# EAGLE design HamOrcaBoard (EAGLE 9.0.1)
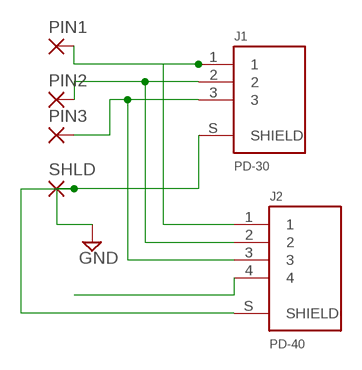
[diagram p0: schematic, sheet 1]

## Parts
J1  PD-30  [CUI_PD-30]
J2  PD-40  [CUI_PD-40]
PIN1  3,81/1,4  [3,81/1,4]
PIN2  3,81/1,4  [3,81/1,4]
PIN3  3,81/1,4  [3,81/1,4]
SHLD  3,81/1,4  [3,81/1,4]

## Nets
GND: J1.S(SHIELD) J2.S(SHIELD) SHLD.1(P)
N$1: J1.1 J2.1 PIN1.1(P)
N$2: J1.2 J2.2 PIN2.1(P)
N$3: J1.3 J2.3 PIN3.1(P)
N$4: J2.4

## Library data of the parts
J1 = PD-30:PD-30: 3 Position , 7.5 A, Right Angle, Through Hole, Power DIN Connector; MF: CUI Inc; PARTREV: B; STANDARD: Manufacturer recommendations
J2 = PD-40:PD-40: 4 Position , 7.5 A, Right Angle, Through Hole, Power DIN Connector; MF: CUI Inc; PARTREV: B; STANDARD: Manufacturer recommendations
PIN1-PIN3 SHLD = wirepad:3,81/1,4: THROUGH-HOLE PAD

## Board
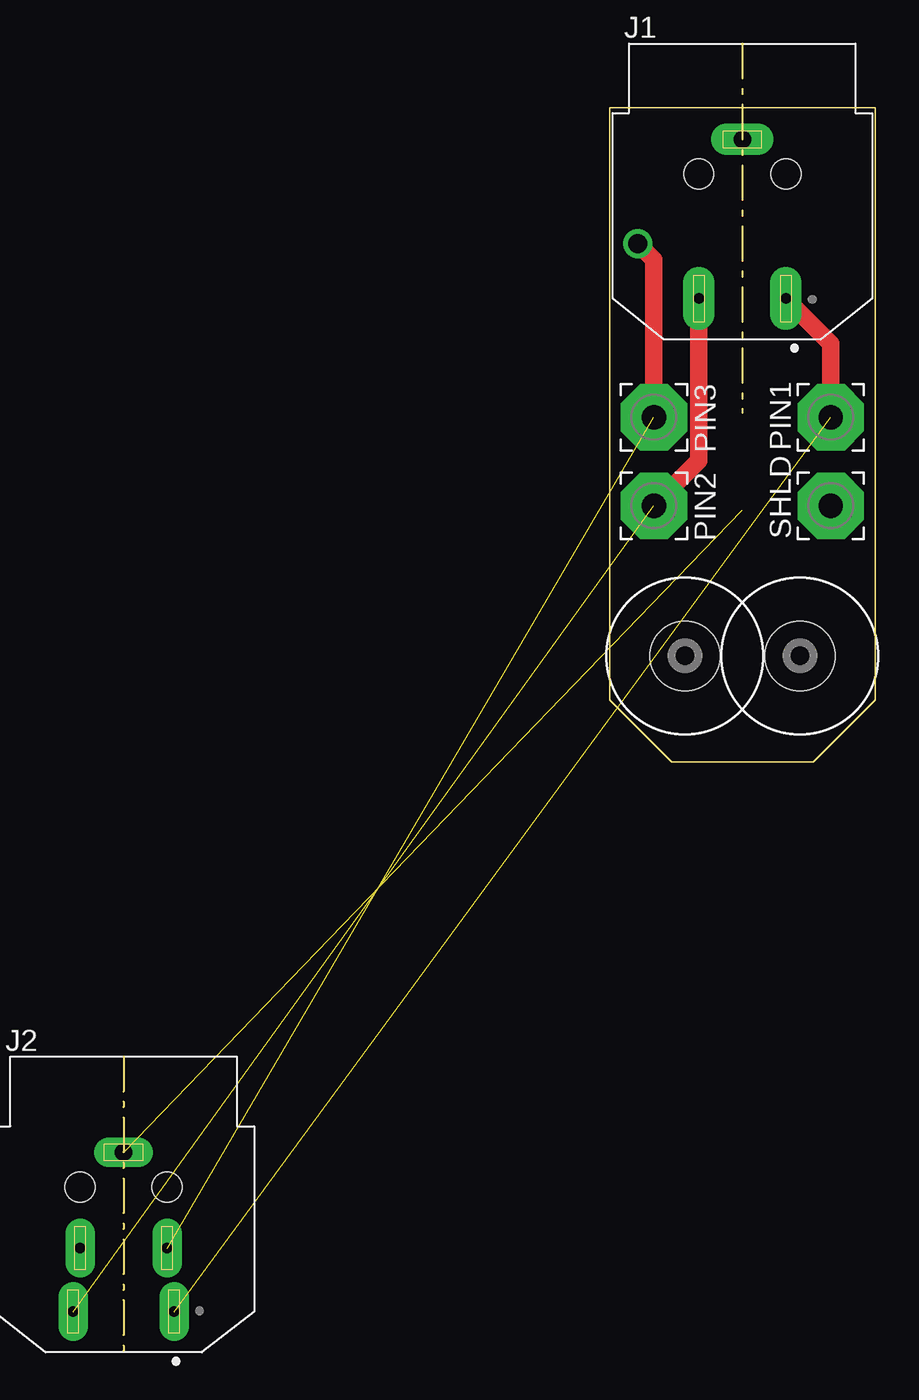
[diagram p1: board, top side]
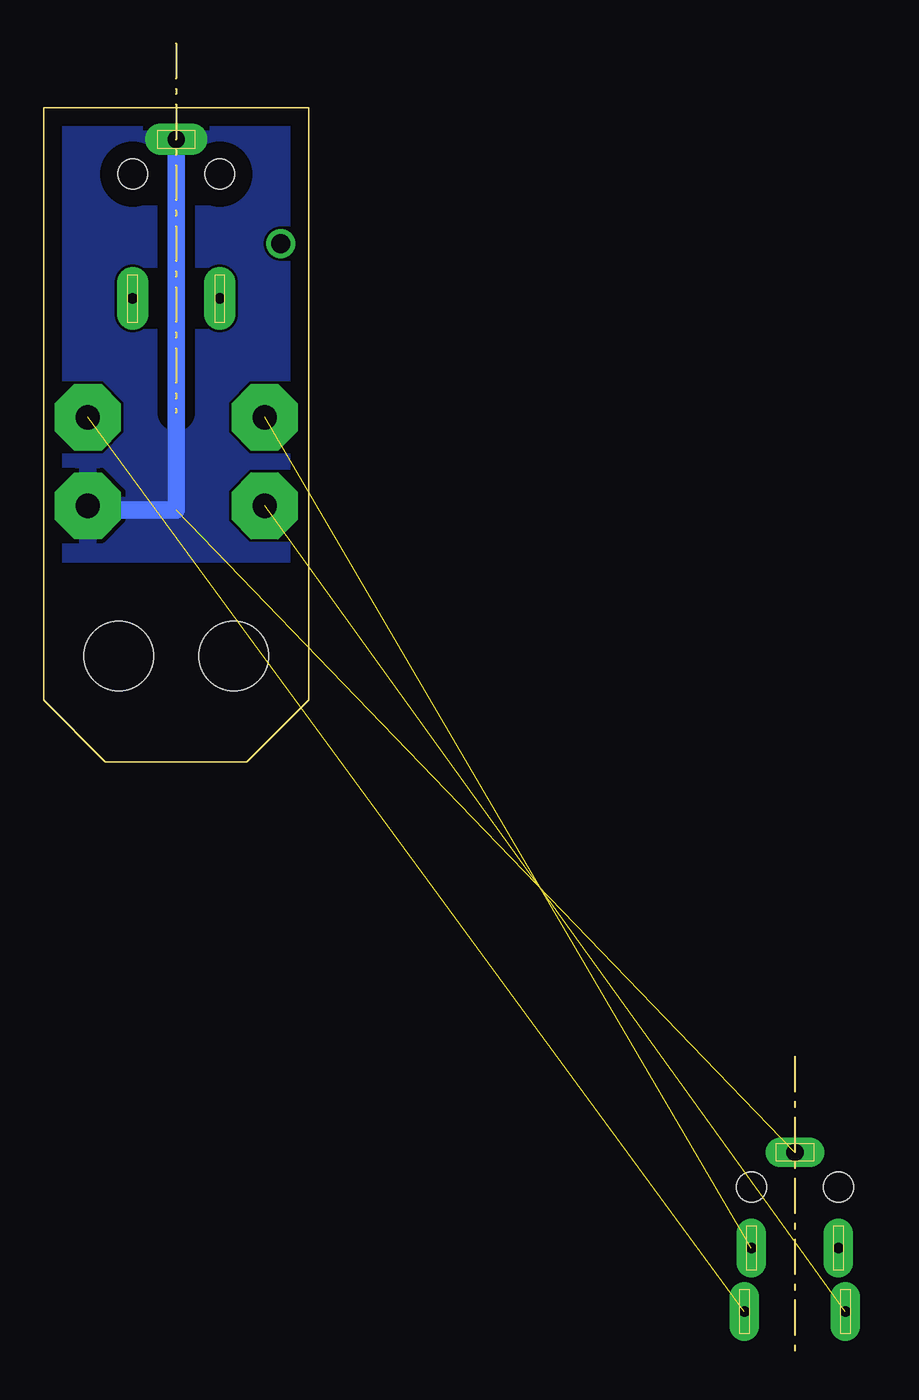
[diagram p2: board, bottom side, seen from below]

Size 15.24 x 37.59 mm. Coordinates in mm from the lower left corner, seen from the top.
Outline: 0,37.59 15.24,37.59 15.24,3.56 11.68,0 3.56,0 0,3.56 0,37.59
Copper layers (1*16): Top 0.035mm / dielectric 1.5mm / Bottom 0.035mm
Design rules "default": minimum track width 6mil, minimum drill 0.35mm, track to track 6mil, track to pad 6mil, pad to pad 6mil, via to via 6mil, smd to smd 6mil, copper to edge 40mil, drill to drill 6mil, minimum pad ring 10mil, minimum via ring 8mil, stop-mask expansion 4mil, vias tented up to drill 0mil, thermal gap 10mil

### Footprints (pad centres in the part's own frame; a part is rotated, then mirrored left to right if it is on the bottom)
CUI_PD-30 = drill 0.6 pad 1.8 long: 1 2.5,-7.15; 2 -2.5,-7.15 | drill 1.1: 3 -6,-4 | drill 1 pad 1.8 long: S 0,2 | hole 1.7: -2.5,0; 2.5,0
CUI_PD-40 = drill 0.6 pad 1.7 long: 1 2.9,-7.15; 2 -2.9,-7.15; 3 2.5,-3.5; 4 -2.5,-3.5 | drill 1 pad 1.7 long: S 0,2 | hole 1.7: -2.5,0; 2.5,0
3,81/1,4 = drill 1.397 pad 3.81 octagon: 1 0,0
DRIL-4 = hole 4: 0,0

### Placement (x,y rotation side)
J1  7.62,33.78 0 top
J2  -27.91,-24.42 0 top  (outside the outline)
PIN1  12.7,19.81 90 top
PIN2  2.54,14.73 270 top
PIN3  2.54,19.81 270 top
SHLD  12.7,14.73 90 top
U$1  [DRIL-4]  4.32,6.1 0 top
U$2  [DRIL-4]  10.92,6.1 0 top

### Tracks (layer width: path | path; a pad name or v marks a point on that pad's centre or on a via)
GND  (1 unrouted)
  Bottom 1.016: J1.S 7.62,14.48 12.45,14.48 SHLD.1
  pour Bottom: 0.51,11.94 14.99,11.94 14.99,37.08 0,37.08 0,12.19
N$1  (1 unrouted)
  Top 1.016: PIN1.1 12.7,24.05 J1.1
N$2  (1 unrouted)
  Top 1.016: J1.2 5.12,17.31 PIN2.1
N$3  (1 unrouted)
  Top 1.016: J1.3 2.54,28.86 PIN3.1